# EAGLE design mbpwr (EAGLE 5.11)
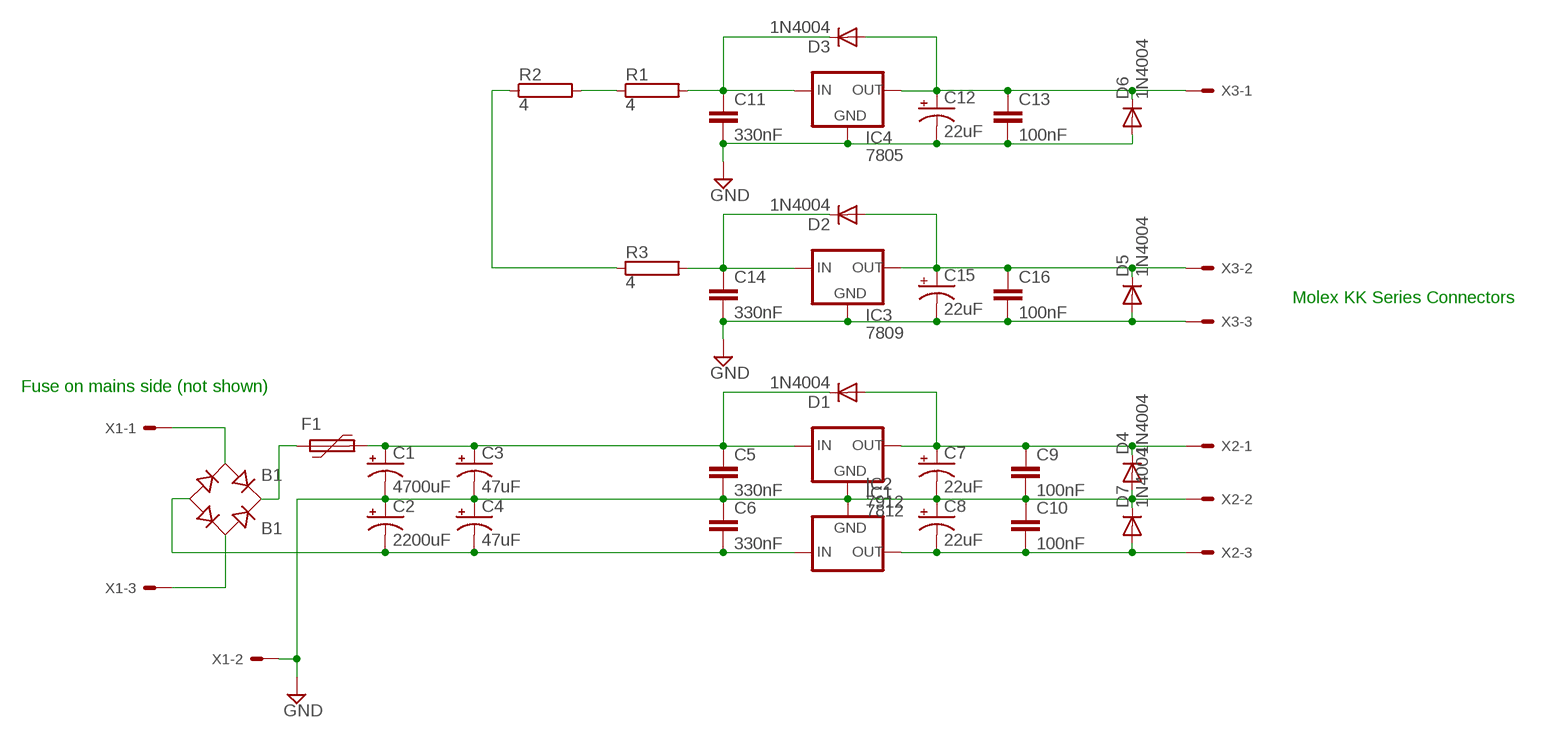
[diagram p0: schematic, sheet 1]

## Parts
B1  B1  RB1A  [RB1A]
C1  4700uF  CPOL-USE7.5-18  [E7,5-18]
C2  2200uF  CPOL-USE7.5-16  [E7,5-16]
C3  47uF  CPOL-USE2.5-5  [E2,5-5]
C4  47uF  CPOL-USE2.5-5  [E2,5-5]
C5  330nF  C-EU025-025X050  [C025-025X050]
C6  330nF  C-EU025-025X050  [C025-025X050]
C7  22uF  CPOL-USE2-5  [E2-5]
C8  22uF  CPOL-USE2-5  [E2-5]
C9  100nF  C-EU025-025X050  [C025-025X050]
C10  100nF  C-EU025-025X050  [C025-025X050]
C11  330nF  C-EU025-025X050  [C025-025X050]
C12  22uF  CPOL-USE2-5  [E2-5]
C13  100nF  C-EU025-025X050  [C025-025X050]
C14  330nF  C-EU025-025X050  [C025-025X050]
C15  22uF  CPOL-USE2-5  [E2-5]
C16  100nF  C-EU025-025X050  [C025-025X050]
D1  1N4004  [DO41-10]
D2  1N4004  [DO41-10]
D3  1N4004  [DO41-10]
D4  1N4004  [DO41-10]
D5  1N4004  [DO41-10]
D6  1N4004  [DO41-10]
D7  1N4004  [DO41-10]
F1  MF-R055-5,1  [MF-5,1]
IC1  7812  78XXS  [78XXS]
IC2  7912  79XXS  [79XXS]
IC3  7809  78XXS  [78XXS]
IC4  7805  78XXS  [78XXS]
R1  4  RKH206-8  [KH206-8]
R2  4  RKH206-8  [KH206-8]
R3  4  RKH206-8  [KH206-8]
X1  KK-156-3  [KK-156-3]
X2  KK-156-3  [KK-156-3]
X3  KK-156-3  [KK-156-3]

## Nets
+5VDC: C12.+ C13.1 D3.A D6.C IC4.OUT X3.1
+9VDC: C15.+ C16.1 D2.A D5.C IC3.OUT X3.2
+12VDC: C7.+ C9.1 D1.A D4.C IC1.OUT X2.1
+12VDC_UNREG: C1.+ C3.+ C5.1 D1.C F1.2 IC1.IN
-12VDC: C8.- C10.2 D7.A IC2.OUT X2.3
-12VDC_UNREG: B1.- C2.- C4.- C6.2 IC2.IN
GND: C1.- C2.+ C3.- C4.+ C5.2 C6.1 C7.- C8.+ C9.2 C10.1 C11.2 C12.- C13.2 C14.2 C15.- C16.2 D4.A D5.A D6.A D7.C IC1.GND IC2.GND IC3.GND IC4.GND X1.2 X2.2 X3.3
N$1: C11.1 D3.C IC4.IN R1.2
N$2: C14.1 D2.C IC3.IN R3.2
N$3: R1.1 R2.2
N$4: R2.1 R3.1
N$5: B1.AC1 X1.1
N$6: B1.AC2 X1.3
N$8: B1.+ F1.1

## Notes on the sheet
- Molex KK Series Connectors
- Fuse on mains side (not shown)

## Library data of the parts
B1 = rectifier:RB1A: RECTIFIER 1 A
C1 C2 C7 C8 C12 C15 = rcl:CPOL-US: POLARIZED CAPACITOR, American symbol
C3 C4 = resistor:CPOL-US: POLARIZED CAPACITOR, American symbol
C5 C6 C9-C11 C13 C14 C16 = rcl:C-EU: CAPACITOR, European symbol
D1-D7 = diode:1N4004: DIODE general purpose rectifier, 1 A
F1 = BOURNS:MF-R055: MultiFuse Polyfuse Overcurrent Protectors
IC1 IC3 IC4 = v-reg:78XXS: VOLTAGE REGULATOR
IC2 = v-reg:79XXS: VOLTAGE REGULATOR
R1-R3 = resistor-power:R: Power Resitor
X1-X3 = con-molex:KK-156-3: KK 156 HEADER Source: http://www.molex.com/pdm_docs/sd/026604100_sd.pdf; OC_FARNELL: unknown; OC_NEWARK: unknown

## Board
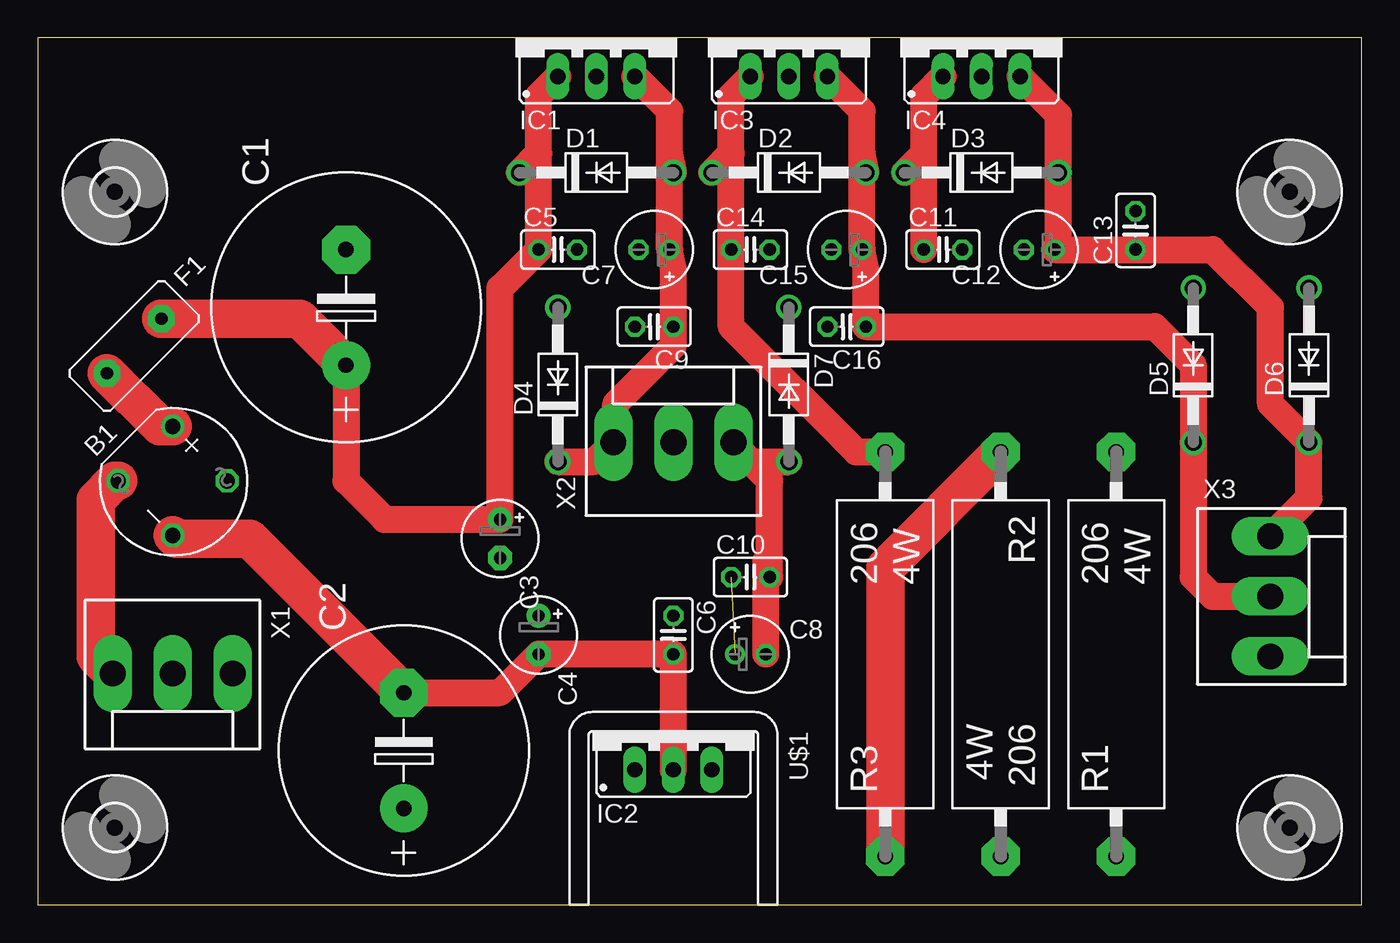
[diagram p1: board, top side]
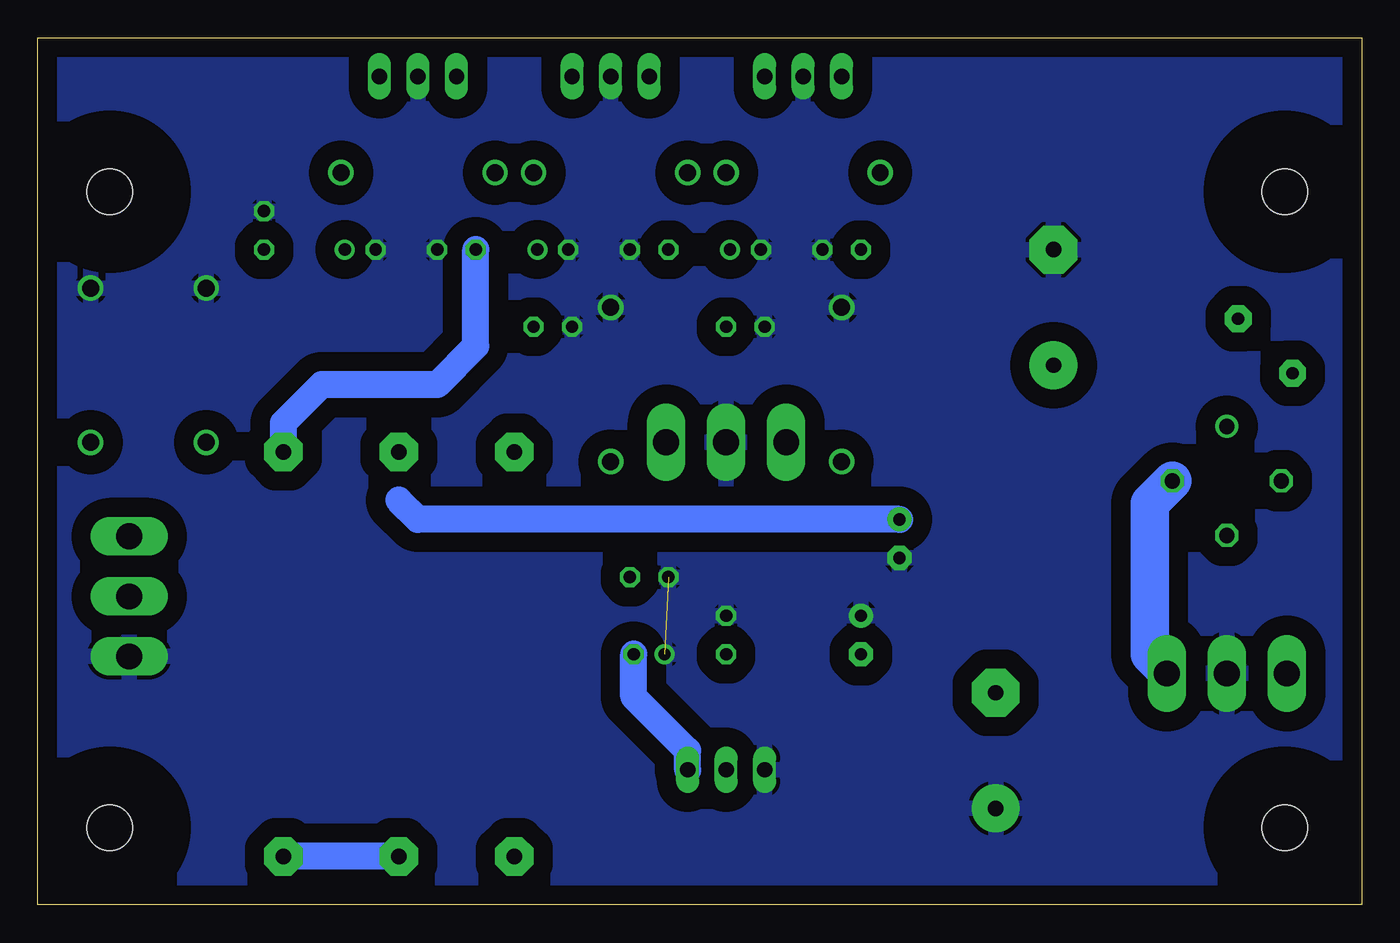
[diagram p2: board, bottom side, seen from below]

Size 87.3 x 57.14 mm. Coordinates in mm from the lower left corner, seen from the top.
Outline: 0,0 87.3,0 87.3,57.14 0,57.14 0,0
Copper layers (1*16): Top 0.035mm / dielectric 1.5mm / Bottom 0.035mm
Design rules "default": minimum track width 10mil, minimum drill 24mil, track to track 8mil, track to pad 8mil, pad to pad 8mil, via to via 8mil, smd to smd 8mil, copper to edge 40mil, drill to drill 8mil, minimum pad ring 10mil, minimum via ring 8mil, stop-mask expansion 4mil, vias tented up to drill 0mil, thermal gap 10mil

### Footprints (pad centres in the part's own frame; a part is rotated, then mirrored left to right if it is on the bottom)
RB1A = drill 1.016 round: + -2.54,2.54 | drill 1.016 octagon: - 2.54,-2.54; AC1 2.54,2.54; AC2 -2.54,-2.54
E7,5-18 = drill 1.016 pad 3.15 round: + -3.81,0 | drill 1.016 pad 3.15 octagon: - 3.81,0
E7,5-16 = drill 1.016 pad 3.15 round: + -3.81,0 | drill 1.016 pad 3.15 octagon: - 3.81,0
E2,5-5 = drill 0.813 pad 1.6 round: + -1.27,0 | drill 0.813 pad 1.6 octagon: - 1.27,0
C025-025X050 = drill 0.813 octagon: 1 -1.27,0; 2 1.27,0
E2-5 = drill 0.813 pad 1.27 round: + -1.016,0 | drill 0.813 pad 1.27 octagon: - 1.016,0
DO41-10 = drill 1.118 round: A 5.08,0; C -5.08,0
MF-5,1 = drill 0.813 pad 1.778 octagon: 1 -2.54,0; 2 2.54,0
78XXS = drill 1.016 long: GND 0,-2.54; IN -2.54,-2.54; OUT 2.54,-2.54
79XXS = drill 1.016 long: GND -2.54,-2.54; IN 0,-2.54; OUT 2.54,-2.54
KH206-8 = drill 1.016 pad 2.54 octagon: 1 -13.335,0; 2 13.335,0
3,0 = hole 3: 0,0
KK-156-3 = drill 1.7 pad 2.184 long: 1 -3.96,0; 2 0,0; 3 3.96,0

### Placement (x,y rotation side)
B1  8.89,27.94 315 top
C1  20.32,39.37 90 top
C2  24.13,10.16 90 top
C3  30.48,24.13 270 top
C4  33.02,17.78 270 top
C5  34.29,43.18 0 top
C6  41.91,17.78 270 top
C7  40.64,43.18 180 top
C8  46.99,16.51 0 top
C9  40.64,38.1 180 top
C10  46.99,21.59 0 top
C11  59.69,43.18 0 top
C12  66.04,43.18 180 top
C13  72.39,44.45 90 top
C14  46.99,43.18 0 top
C15  53.34,43.18 180 top
C16  53.34,38.1 180 top
D1  36.83,48.26 0 top
D2  49.53,48.26 0 top
D3  62.23,48.26 0 top
D4  34.29,34.29 90 top
D5  76.2,35.56 90 top
D6  83.82,35.56 90 top
D7  49.53,34.29 270 top
F1  6.35,36.83 45 top
IC1  36.83,57.15 0 top
IC2  41.91,11.43 0 top
IC3  49.53,57.15 0 top
IC4  62.23,57.15 0 top
R1  71.12,16.51 90 top
R2  63.5,16.51 270 top
R3  55.88,16.51 90 top
U$1  [D01S]  41.91,11.43 180 top
U$2  [3,0]  5.08,5.08 0 top
U$3  [3,0]  5.08,46.99 0 top
U$4  [3,0]  82.55,46.99 0 top
U$5  [3,0]  82.55,5.08 0 top
X1  8.89,15.24 180 top
X2  41.91,30.48 0 top
X3  81.28,20.32 270 top

### Tracks (layer width: path | path; a pad name or v marks a point on that pad's centre or on a via)
+5VDC
  Top 1.778: X3.1 83.82,26.82 D6.C 81.28,33.02 81.28,39.37 77.47,43.18 C13.1 C12.+ 67.31,43.43 D3.A 67.31,52.07 IC4.OUT
+9VDC
  Top 1.778: X3.2 77.47,20.32 76.2,21.59 D5.C 76.2,35.56 73.66,38.1 C16.1 54.61,41.91 C15.+ 54.36,49.53 | 54.36,49.53 54.36,52.32 IC3.OUT | 54.36,49.53 D2.A
+12VDC
  Top 1.778: D4.C 36.68,29.21 X2.1 38.1,30.63 38.1,33.02 41.91,36.83 C9.1 41.91,41.91 C7.+ 41.66,49.53 | 41.66,49.53 41.66,52.32 IC1.OUT | 41.66,49.53 D1.A
+12VDC_UNREG
  Top 1.778: C1.+ 20.32,27.94 22.86,25.4 C3.+ 30.48,40.64 C5.1 33.02,49.53 | 33.02,49.53 33.02,53.34 IC1.IN | 33.02,49.53 D1.C
  Top 2.54: F1.2 17.25,38.63 C1.+
  Bottom 1.778: 63.5,26.67 62.23,25.4 C3.+
-12VDC
  Top 1.778: X2.3 45.87,30.33 46.35,29.84 46.99,29.21 | 46.99,29.21 48.26,27.94 C10.2 48.01,22.61 C8.- | 46.99,29.21 D7.A
  Bottom 1.778: IC2.OUT 44.45,10.16 48.01,13.72 C8.-
-12VDC_UNREG
  Top 1.778: C2.- 30.48,13.97 C4.- C6.2 IC2.IN
  Top 2.54: C2.- 13.97,24.13 9.11,24.13 B1.-
GND  (1 unrouted)
  pour Bottom (isolate 1.27): 0,57.15 87.63,57.15 87.63,0 0,0
N$1
  Top 1.778: C11.1 58.42,49.53 | 58.42,49.53 58.42,53.34 IC4.IN | 58.42,49.53 D3.C
  Bottom 1.778: C11.1 58.42,36.83 60.96,34.29 68.58,34.29 71.12,31.75 R1.2
N$2
  Top 1.778: R3.2 53.98,29.84 45.72,38.1 C14.1 45.72,49.53 | 45.72,49.53 45.72,53.34 IC3.IN | 45.72,49.53 D2.C
N$3
  Bottom 1.778: R2.2 R1.1
N$4
  Top 2.54: R3.1 55.88,22.23 R2.1
N$5
  Bottom 2.54: X1.1 12.85,15.39 13.97,16.51 13.97,26.45 B1.AC1
N$6
  Top 2.54: B1.AC2 5.08,27.94 3.81,26.67 3.81,16.36 X1.3
N$8
  Top 2.54: B1.+ 8.06,31.53 F1.1